# Altium schematic sheet P01_Power.SchDoc
size A4; SheetNumber: 1; SheetTotal: 3
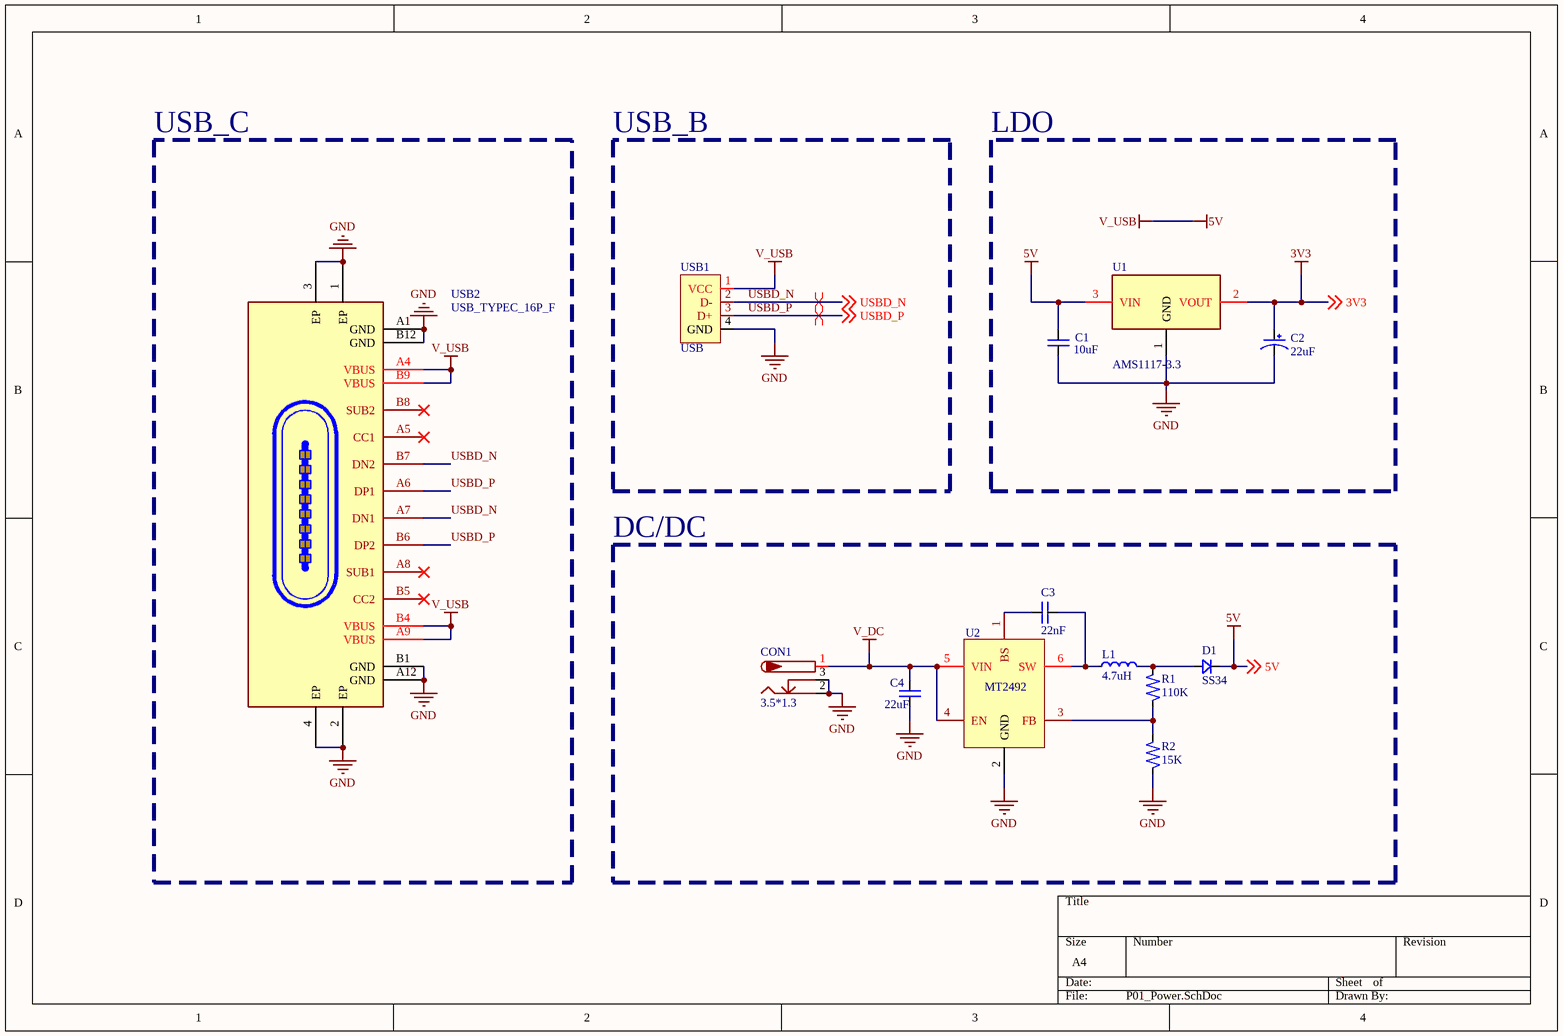
[diagram p0: P01_Power.SchDoc]

## Parts
C1  10uF  [C_0805]
C2  22uF  [CASE-A-3216]
C3  22nF  [C_0603]
C4  22uF  [C_0603]
CON1  3.5*1.3  [DC_Input]
D1  SS34  [SMA]
L1  4.7uH  [L_SMD0420]
R1  110K  [R_0603]
R2  15K  [R_0603]
U1  AMS1117-3.3  [SOT-223]
U2  MT2492  [SOT23-6]
USB1  USB  [USB_TYPEB_4P]
USB2  USB_TYPEC_16P_F  [USB_TYPEC_16P]

## Blocks framed on the sheet
USB_C: USB2
USB_B: USB1
LDO: C1 C2 U1
DC/DC: C3 C4 CON1 D1 L1 R1 R2 U2

## Nets
3V3: C2.1 U1.2(VOUT) ; off-sheet 3V3
5V: C1.1 D1.1 U1.3(VIN) USB1.1(VCC) USB2.A4(VBUS) USB2.A9(VBUS) USB2.B4(VBUS) USB2.B9(VBUS) ; off-sheet 5V  [also labelled V_USB]
GND: C1.2 C2.2 C4.2 CON1.2 CON1.3 R2.1 U1.1(GND) U2.2(GND) USB1.4(GND) USB2.1(EP) USB2.2(EP) USB2.3(EP) USB2.4(EP) USB2.A1(GND) USB2.A12(GND) USB2.B1(GND) USB2.B12(GND)
V_DC: C4.1 CON1.1 U2.4(EN) U2.5(VIN)
USBD_N: USB1.2(D-) USB2.A7(DN1) USB2.B7(DN2) ; off-sheet USBD_N
USBD_P: USB1.3(D+) USB2.A6(DP1) USB2.B6(DP2) ; off-sheet USBD_P
NetC3_1: C3.1 U2.1(BS)
NetC3_2: C3.2 L1.2 U2.6(SW)
NetD1_2: D1.2 L1.1 R1.2
NetR1_1: R1.1 R2.2 U2.3(FB)

Not connected (* = marked no-connect by the designer): USB2 A5(CC1)* A8(SUB1)* B5(CC2)* B8(SUB2)*

## Layout directives
differential pair: USBD_N, USBD_P

## Library data of the parts
C1 C3 C4 = C: 无极性电容
C2 = C_Tan: Tantalum Capacitor / 钽电容
CON1 = DC_Input: 低压电源接口
D1 = D: Diode
L1 = L: Inductor
R1 R2 = R: Resistor
U1 = AMS1117-3.3: LDO to 3V3
U2 = MT2492: BUCK / https://atta.szlcsc.com/upload/public/pdf/source/20221209/5C81DA9662873D3A116170FFBF63E49D.pdf
USB1 = USB_4Pin
USB2 = USB_TYPEC_16P_F: USB母座，TYPEC，16pin